# Altium schematic sheet Sheet1.SchDoc
size A; SheetNumber: 1; SheetTotal: 1
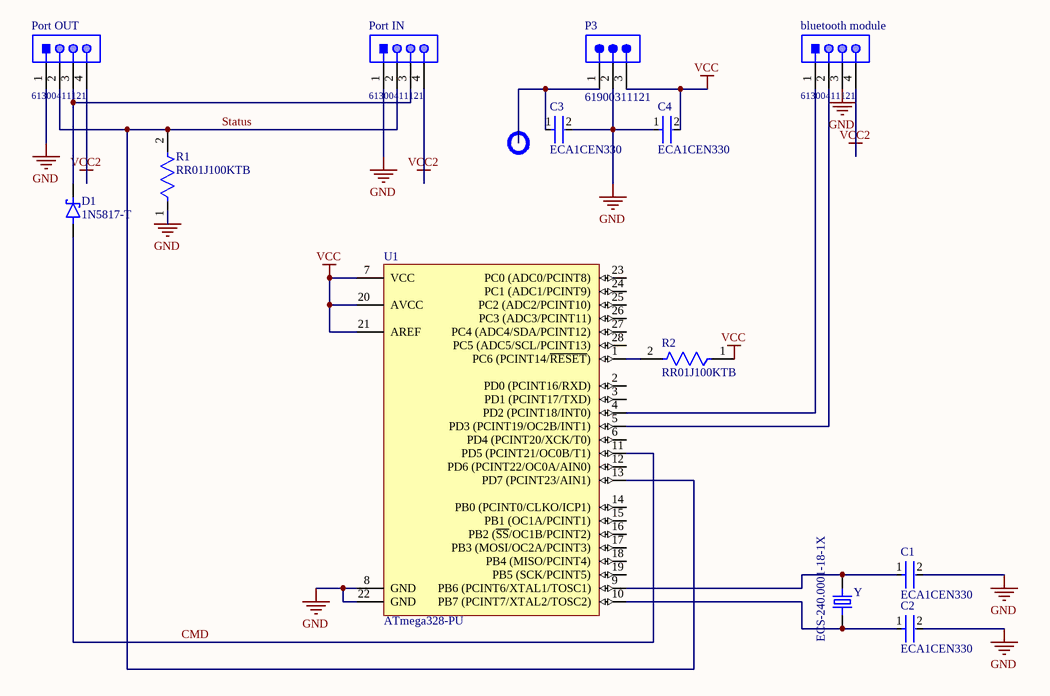
[diagram p0: Sheet1.SchDoc]

## Parts
bluetooth_module  61300411121  [61300411121]
C1  ECA1CEN330  [FP-RAD-TH-D_5_0_5-L_11_1-MFG]
C2  ECA1CEN330  [FP-RAD-TH-D_5_0_5-L_11_1-MFG]
C3  ECA1CEN330  [FP-RAD-TH-D_5_0_5-L_11_1-MFG]
C4  ECA1CEN330  [FP-RAD-TH-D_5_0_5-L_11_1-MFG]
D1  1N5817-T  [DIOAD1039W78L463D236]
P3  61900311121  [61900311121]
Port_IN  61300411121  [61300411121]
Port_OUT  61300411121  [61300411121]
R1  RR01J100KTB  [FP-RR01-MFG]
R2  RR01J100KTB  [FP-RR01-MFG]
U1  ATmega328-PU  [28P3]
Y  ECS-240.0001-18-1X  [XTAL_ECS-200-20-1X]

## Nets
GND: bluetooth_module.3 C1.2 C2.2 C3.2 C4.1 P3.2 Port_IN.1 Port_OUT.1 R1.1 U1.8(GND) U1.22(GND)
VCC: C4.2 P3.3 R2.1 U1.7(VCC) U1.20(AVCC) U1.21(AREF)
VCC2: bluetooth_module.4 Port_IN.4 Port_OUT.4
CMD: D1.2(A) U1.11(PD5_(PCINT21/OC0B/T1))
Status: Port_IN.2 Port_OUT.2 R1.2 U1.13(PD7_(PCINT23/AIN1))
Netbluetooth_module_1: bluetooth_module.1 U1.4(PD2_(PCINT18/INT0))
Netbluetooth_module_2: bluetooth_module.2 U1.5(PD3_(PCINT19/OC2B/INT1))
NetC1_1: C1.1 U1.9(PB6_(PCINT6/XTAL1/TOSC1)) Y.2
NetC2_1: C2.1 U1.10(PB7_(PCINT7/XTAL2/TOSC2)) Y.1
NetC3_1: C3.1 P3.1
NetD1_1: D1.1(K) Port_IN.3 Port_OUT.3
NetR2_2: R2.2 U1.1(PC6_(PCINT14/~{RESET}))

Not connected (* = marked no-connect by the designer): U1 2(PD0_(PCINT16/RXD)) 3(PD1_(PCINT17/TXD)) 6(PD4_(PCINT20/XCK/T0)) 12(PD6_(PCINT22/OC0A/AIN0)) 14(PB0_(PCINT0/CLKO/ICP1)) 15(PB1_(OC1A/PCINT1)) 16(PB2_(~{SS}/OC1B/PCINT2)) 17(PB3_(MOSI/OC2A/PCINT3)) 18(PB4_(MISO/PCINT4)) 19(PB5_(SCK/PCINT5)) 23(PC0_(ADC0/PCINT8)) 24(PC1_(ADC1/PCINT9)) 25(PC2_(ADC2/PCINT10)) 26(PC3_(ADC3/PCINT11)) 27(PC4_(ADC4/SDA/PCINT12)) 28(PC5_(ADC5/SCL/PCINT13))

## Library data of the parts
bluetooth_module Port_IN Port_OUT = CMP-1502-01064-1: THT Vertical Pin Header WR-PHD, Pitch 2.54 mm, Single Row, 4 pins; Manufacturer: Wurth Elektronik; Withstanding Voltage: 500VAC; Rated Current: 3A; Working Voltage: 250VAC; Pin Number: 4; Gender: Male; Contact Resistance: 20mOhm; Pitch: 2.54mm; Manufacturer URL: http://www.we-online.de; Operating Temperature: -40to105degC; Packaging: Bag; Mounting Technology: THT; Package Reference: 61300411121; Datasheet URL: https://katalog.we-online.de/em/datasheet/6130xx11121.pdf; Publisher: WurthElektronik; Part Number: 61300411121; Row Number: Single; Orientation: Vertical
C1-C4 = CMP-05427-001881-1: Aluminum Electrolytic Capacitors (Radial Lead Type) 33uF ±20% 16V; Ripple Current: 80mA; Lead/Base Style: Straight; Series: GA; Max Operating Temperature: 105°C; Package Quantity: 200; Lead Pitch: 2mm; Min Operating Temperature: -40°C; Mount: Through Hole; Termination: Radial; RoHS Compliant: Yes; Capacitance: 33uF; Packaging: Ammo Pack; Tolerance: 20%; Voltage Rating (DC): 16V; Case/Package: Radial
D1 = 1N5817-T: Diode Schottky 20 V 1A Through Hole DO-41; MF: Diodes Inc.; Package: DO-41 Diodes Inc.; Price: None; Check_prices: https://www.snapeda.com/parts/1N5817-T/Diodes+Inc./view-part/?ref=eda; Value: *; SnapEDA_Link: https://www.snapeda.com/parts/1N5817-T/Diodes+Inc./view-part/?ref=snap; MP: 1N5817-T; Availability: In Stock; Purchase-URL: https://pricing.snapeda.com/search/part/1N5817-T/?ref=eda
P3 = CMP-1502-00585-2: NexarPartId: 18818222; Current Rating: 3A; Voltage Rating: 250V; Number of Positions: 3; Insulation Resistance: 1GΩ; Gender: Male; Pitch: 2.54mm; Connector Type: Male Pin; Contact Resistance: 20mΩ; Termination: Through Hole; Width: 7.66mm; Contact Plating: Tin; Orientation: Vertical; Mount: Through Hole; Contact Gender: Male; Max Operating Temperature: 105°C; Length: 7.62mm; Number of Rows: 1; Height: 12.5mm; Lead Pitch: 2.54mm; Housing Material: Nylon; Color: Beige; Contact Material: Copper; Fastening Type: Friction; Min Operating Temperature: -40°C; Number of Contacts: 3; Number of Pins: 3; Flammability Rating: UL94 V-0; Contact Mating Length: 7.493mm; RoHS: Compliant; REACH SVHC: Unknown; Packaging: Bulk; Operating Supply Voltage: 250V
R1 R2 = CMP-03212-000008-1: RES 100K OHM 5% 1W AXIAL; Number of Resistors: 1; Temperature Coefficient: 300ppm/°C; Voltage Rating: 350V; Resistance: 100kR; Package Quantity: 5000; Power Rating: 1W; Packaging: Ammo Pack; Min Operating Temperature: -55°C; Number of Terminations: 2; Resistor Type: Power resistor; Length: 6.8mm; ELV: Compliant; Mount: Axial; RoHS Compliant: Yes; Case/Package: Metal; Diameter: 2.6mm; Termination: Axial; Series: RR; Max Operating Temperature: 155°C; Tolerance: 5%
U1 = CMP-0095-00015-2: 8-bit AVR Microcontroller, 32KB Flash, 1KB EEPROM, 2KB SRAM, 28-pin PDIP, Industrial Grade (-40°C to 85°C); ComponentLink3Description: ATmega48A/48PA/88A/88PA/168A/168PA/328/328P Summary; RevisionNote: DatasheetVersion updated. URLs added.; DatasheetVersion: revD, May-2011; ComponentLink1URL: http://www.atmel.com/; PackageVersion: revB, Sep-2001; PackageDescription: 28-lead (0.300"/7.62mm Wide) Plastic Dual Inline Package (PDIP); PackageReference: 28P3; ComponentLink1Description: Manufacturer URL; ComponentLink2Description: ATmega48A/48PA/88A/88PA/168A/168PA/328/328P Datasheet; ComponentLink3URL: http://www.atmel.com/dyn/resources/prod_documents/8271S.pdf; ComponentLink2URL: http://www.atmel.com/dyn/resources/prod_documents/8271.pdf
Y = ECS-240.0001-18-1X: Crystals / Oscillators / Resonators 24.00014MHz 18pF; MF: ECS International; Package: HC49/U ECS International; Availability: Unavailable; Value: *; MP: ECS-240.0001-18-1X; Price: None; SnapEDA_Link: https://www.snapeda.com/parts/ECS-240.0001-18-1X/ECS%20International/view-part/259232/?ref=snap